# EAGLE design schematic (EAGLE 9.6.2)
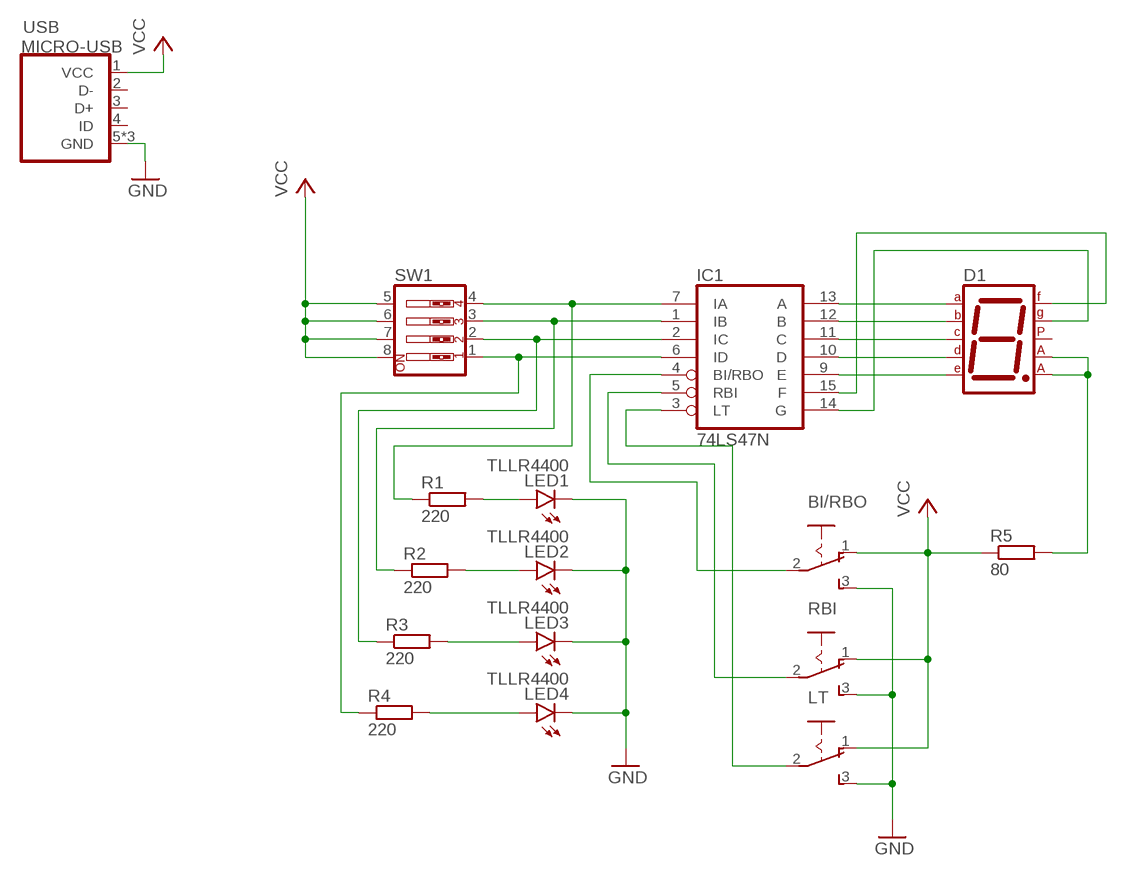
[diagram p0: schematic, sheet 1]

## Parts
BI/RBO  255SB  [255SB]
D1  7SEG-CA  [7SEG-13]
IC1  74LS47N  [DIL16]
LED1  TLLR4400  [LED3MM]
LED2  TLLR4400  [LED3MM]
LED3  TLLR4400  [LED3MM]
LED4  TLLR4400  [LED3MM]
LT  255SB  [255SB]
R1  220  R-EU_0207/10  [0207/10]
R2  220  R-EU_0207/10  [0207/10]
R3  220  R-EU_0207/10  [0207/10]
R4  220  R-EU_0207/10  [0207/10]
R5  80  R-EU_0207/10  [0207/10]
RBI  255SB  [255SB]
SW1  SW_DIP-4  [EDG-04]
USB  MICRO-USB  [MICRO-USB]

## Nets
GND: BI/RBO.3(S) LED1.K(C) LED2.K(C) LED3.K(C) LED4.K(C) LT.3(S) RBI.3(S) USB.5(GND) USB.GND1(GND) USB.GND2(GND)
N$1: IC1.7(IA) R1.1 SW1.4
N$2: IC1.1(IB) R2.1 SW1.3
N$3: IC1.2(IC) R3.1 SW1.2
N$4: IC1.6(ID) R4.1 SW1.1
N$5: LED1.A R1.2
N$6: D1.7(A) IC1.13(A)
N$7: LED2.A R2.2
N$8: D1.6(B) IC1.12(B)
N$9: D1.4(C) IC1.11(C)
N$10: LED3.A R3.2
N$11: LED4.A R4.2
N$12: D1.2(D) IC1.10(D)
N$13: BI/RBO.2(P) IC1.4(BI/RBO)
N$14: IC1.5(RBI) RBI.2(P)
N$15: IC1.3(LT) LT.2(P)
N$16: D1.1(E) IC1.9(E)
N$17: D1.9(F) IC1.15(F)
N$18: D1.10(G) IC1.14(G)
N$20: D1.3(CA1) D1.8(CA2) R5.2
VCC: BI/RBO.1(O) LT.1(O) R5.1 RBI.1(O) SW1.5 SW1.6 SW1.7 SW1.8 USB.1(VCC)
Unconnected: D1.5(DP) USB.2(D-) USB.3(D+) USB.4(ID)

## Power pins joined to a net without a drawn wire
GND: IC1.8(GND)
VCC: IC1.16(VCC)

## Library data of the parts
BI/RBO LT RBI = switch:255SB: SLIDING SWITCH Distributor Buerklin, 11G810
D1 = special:7SEG-CA: 7-segment DISPLAY single anode, 13 mm
IC1 = 74xx-eu:74*47: BCD to seven segment DECODER/DRIVER Source: http://www.ee.washington.edu/stores/DataSheets/74ls/74ls47.pdf
LED1-LED4 = led:TLLR4400: Low Current (2mA) LED 3 mm Tinted Diffused Package color RED Source: Data sheet <http://www.farnell.com/datasheets/391100.pdf>; MF: VISHAY SEMICONDUCTOR; OC_FARNELL: 1612437
R1-R5 = rcl:R-EU_: RESISTOR, European symbol; SPICEPREFIX: R
SW1 = special:SW_DIP-4: DIP SWITCH
USB = microusb:MICRO-USB: Micro USB B connector

## Board
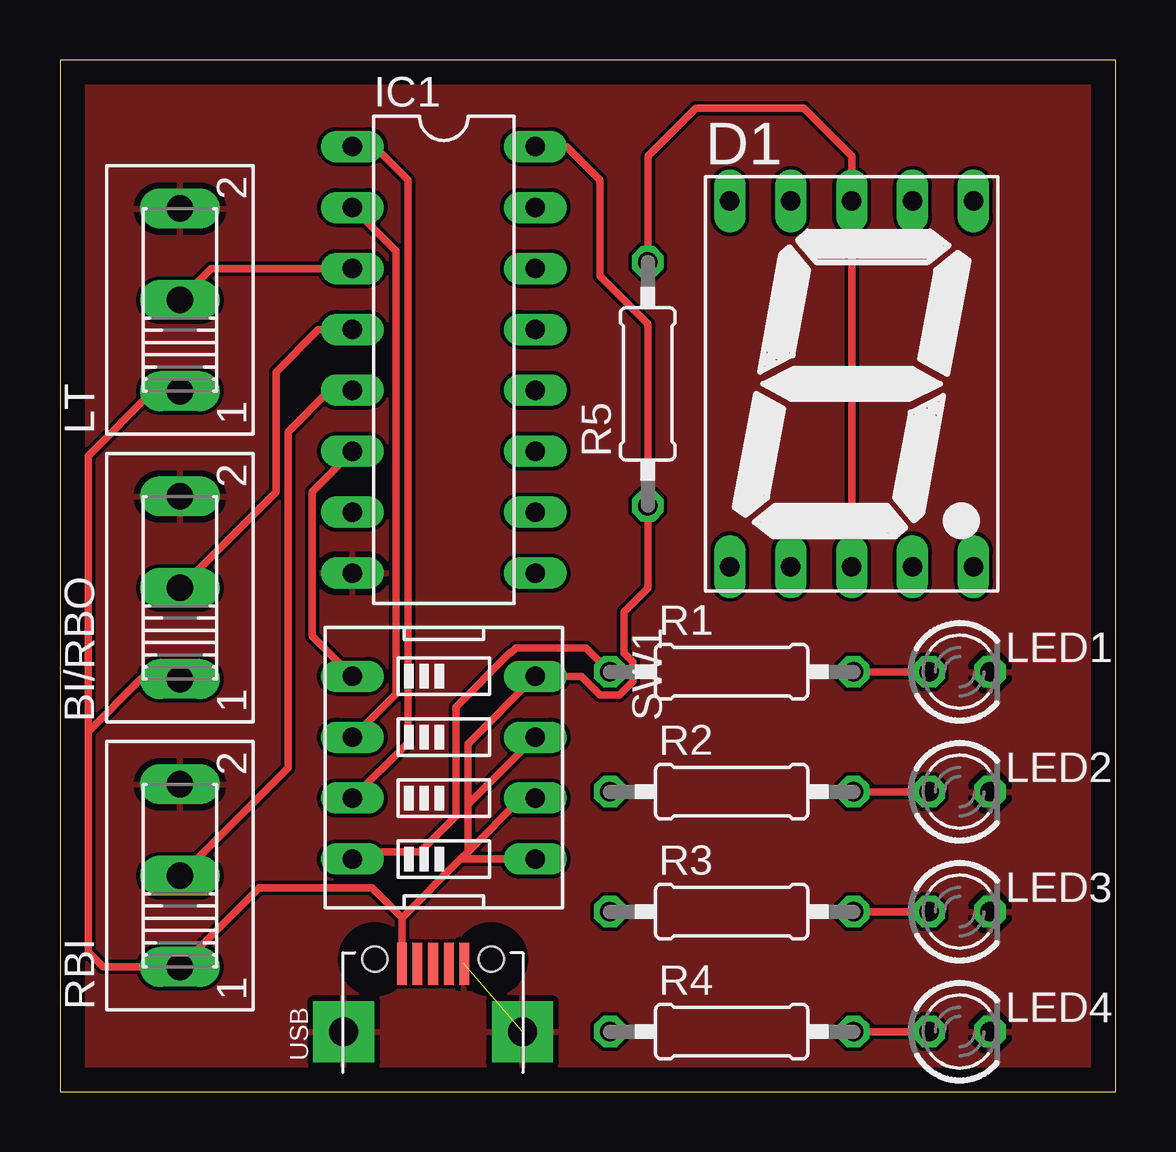
[diagram p1: board, top side]
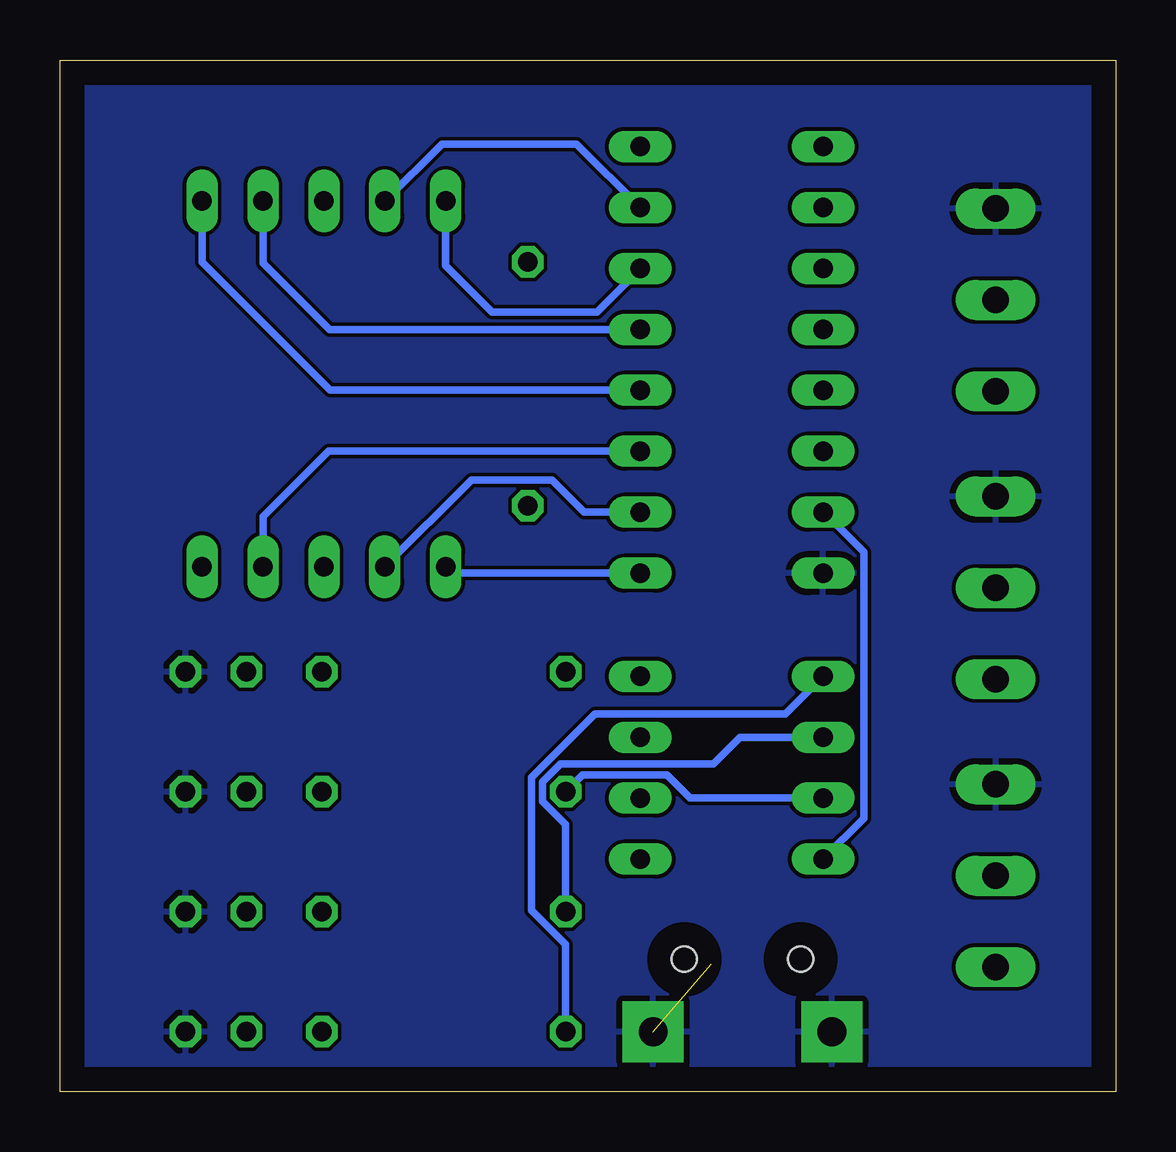
[diagram p2: board, bottom side, seen from below]

Size 44 x 43 mm. Coordinates in mm from the lower left corner, seen from the top.
Outline: 0,0 44,0 44,43 0,43 0,0
Copper layers (1*16): Top 0.035mm / dielectric 1.5mm / Bottom 0.035mm
Design rules "default": minimum track width 6mil, minimum drill 0.35mm, track to track 6mil, track to pad 6mil, pad to pad 6mil, via to via 6mil, smd to smd 6mil, copper to edge 40mil, drill to drill 6mil, minimum pad ring 10mil, minimum via ring 8mil, stop-mask expansion 4mil, vias tented up to drill 0mil, thermal gap 10mil

### Footprints (pad centres in the part's own frame; a part is rotated, then mirrored left to right if it is on the bottom)
255SB = drill 1.118 long: 1 -3.81,0; 2 0,0; 3 3.81,0
7SEG-13 = drill 0.813 long: 1 -5.08,-7.62; 2 -2.54,-7.62; 3 0,-7.62; 4 2.54,-7.62; 5 5.08,-7.62; 6 5.08,7.62; 7 2.54,7.62; 8 0,7.62; 9 -2.54,7.62; 10 -5.08,7.62
DIL16 = drill 0.813 long: 1 -8.89,-3.81; 2 -6.35,-3.81; 3 -3.81,-3.81; 4 -1.27,-3.81; 5 1.27,-3.81; 6 3.81,-3.81; 7 6.35,-3.81; 8 8.89,-3.81; 9 8.89,3.81; 10 6.35,3.81; 11 3.81,3.81; 12 1.27,3.81; 13 -1.27,3.81; 14 -3.81,3.81; 15 -6.35,3.81; 16 -8.89,3.81
LED3MM = drill 0.813 octagon: A -1.27,0; K 1.27,0
0207/10 = drill 0.813 octagon: 1 -5.08,0; 2 5.08,0
EDG-04 = drill 0.813 long: 1 -3.81,-3.81; 2 -1.27,-3.81; 3 1.27,-3.81; 4 3.81,-3.81; 5 3.81,3.81; 6 1.27,3.81; 7 -1.27,3.81; 8 -3.81,3.81
MICRO-USB = smd 0.4 x 1.75: 1 -1.3,4.525; 2 -0.65,4.525; 3 0,4.525; 4 0.65,4.525; 5 1.3,4.525 | drill 1.2 pad 2.54 square: GND1 -3.725,1.7; GND2 3.725,1.7 | hole 1.05: -2.425,4.73; 2.425,4.73

### Placement (x,y rotation side)
BI/RBO  5,21 90 top
D1  33,29.5 0 top
IC1  16,30.5 270 top
LED1  37.5,17.5 0 top
LED2  37.5,12.5 0 top
LED3  37.5,7.5 0 top
LED4  37.5,2.5 0 top
LT  5,33 90 top
R1  28,17.5 0 top
R2  28,12.5 0 top
R3  28,7.5 0 top
R4  28,2.5 0 top
R5  24.5,29.5 90 top
RBI  5,9 90 top
SW1  16,13.5 270 top
USB  15.55,0.79 0 top

### Tracks (layer width: path | path; a pad name or v marks a point on that pad's centre or on a via)
GND  (1 unrouted)
  pour Top: 0,43 0,0 44,0 44,43
  pour Bottom: 0,43 0,0 44,0 44,43
N$1
  Top 0.305: SW1.4 12.5,10 15,10 16.5,11.5 16.5,16.02 18.75,18.27 18.77,18.27 19,18.5 21.92,18.5 R1.1
  Bottom 0.305: SW1.4 10.5,11.38 10.5,22.5 12.15,24.15 IC1.7
N$2
  Top 0.305: SW1.3 14.5,14.54 14.5,38 13.11,39.39 IC1.1
  Bottom 0.305: SW1.3 17.73,12.23 18.7,13.2 22.23,13.2 R2.1
N$3
  Top 0.305: IC1.2 14,35.04 14,16.58 SW1.2
  Bottom 0.305: SW1.2 15.65,14.77 16.77,13.65 23.13,13.65 23.89,12.9 23.89,12.1 22.92,11.13 R3.1
N$4
  Top 0.305: SW1.1 10.5,19 10.5,25 IC1.6
  Bottom 0.305: SW1.1 13.77,15.73 21.7,15.73 24.34,13.09 24.34,7.56 22.92,6.13 R4.1
N$5
  Top 0.305: R1.2 LED1.A
N$6
  Bottom 0.305: D1.7 35.54,34.54 32.77,31.77 IC1.13
N$7
  Top 0.305: R2.2 LED2.A
N$8
  Bottom 0.305: D1.6 38.08,34.58 32.73,29.23 IC1.12
N$9
  Bottom 0.305: D1.4 35.54,23.96 32.81,26.69 IC1.11
N$10
  Top 0.305: R3.2 LED3.A
N$11
  Top 0.305: LED4.A R4.2
N$12
  Bottom 0.305: IC1.10 22.15,24.15 23.5,25.5 26.84,25.5 D1.2
N$13
  Top 0.305: BI/RBO.2 9,25 9,30 10.77,31.77 IC1.4
N$14
  Top 0.305: RBI.2 9.5,13.5 9.5,27.5 11.23,29.23 IC1.5
N$15
  Top 0.305: LT.2 6.31,34.31 IC1.3
N$16
  Bottom 0.305: IC1.9 27.65,21.61 D1.1
N$17
  Bottom 0.305: D1.9 28.08,39.5 22.46,39.5 IC1.15
N$18
  Bottom 0.305: IC1.14 21.62,32.5 26,32.5 27.92,34.42 D1.10
N$20
  Top 0.305: R5.2 24.5,39 26.5,41 31,41 33,39 D1.8 D1.3
VCC
  Top 0.305: IC1.16 21.11,39.39 22.5,38 22.5,34 24.5,32 R5.1 24.5,21 23.5,20 23.5,18.29 23.89,17.9 23.89,17.1 23.32,16.54 22.52,16.54 21.75,17.31 SW1.8 17,14.5 17,11.96 | USB.1 14.25,7.25 | 1.17,15 3.36,17.19 BI/RBO.1 | 1.17,15 1.17,5.83 1.81,5.19 RBI.1 8.31,8.5 13,8.5 14.25,7.25 | 1.17,15 1.17,26.5 3.86,29.19 LT.1 | 14.25,7.25 16.69,9.69 | SW1.5 16.69,9.69 | 16.69,9.69 17,10 | 17,10 19.23,12.23 SW1.6 | 17,10 17,11.96 | SW1.7 17,11.96